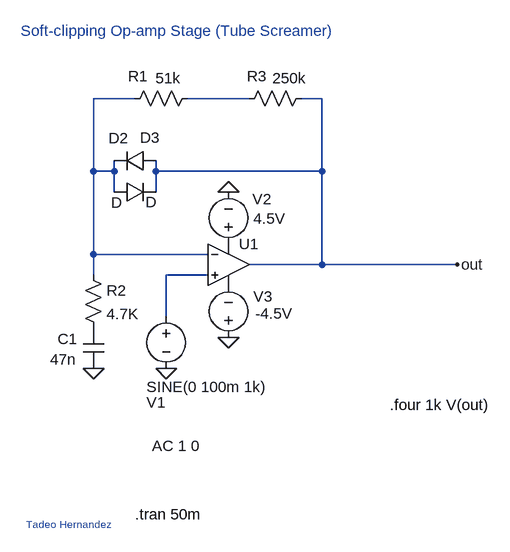
[diagram p0: schematic pedalcircuit.asc]
pedalcircuit.asc, the LTspice schematic file:
Version 4.1
SHEET 1 884 680
WIRE 160 -176 96 -176
WIRE 336 -176 240 -176
WIRE 448 -176 416 -176
WIRE 96 -64 96 -176
WIRE 128 -64 128 -80
WIRE 128 -64 96 -64
WIRE 192 -64 192 -80
WIRE 448 -64 448 -176
WIRE 448 -64 192 -64
WIRE 128 -32 128 -64
WIRE 192 -32 192 -64
WIRE 96 64 96 -64
WIRE 272 64 96 64
WIRE 448 80 448 -64
WIRE 448 80 336 80
WIRE 656 80 448 80
WIRE 96 96 96 64
WIRE 272 96 208 96
WIRE 208 160 208 96
FLAG 96 240 0
FLAG 304 192 0
FLAG 208 240 0
FLAG 304 -32 0
FLAG 656 80 out
SYMBOL diode 192 -96 R90
WINDOW 0 -3 57 VBottom 2
WINDOW 3 64 7 VTop 2
SYMATTR InstName D2
SYMBOL diode 128 -16 R270
WINDOW 0 84 55 VTop 2
WINDOW 3 15 4 VBottom 2
SYMATTR InstName D3
SYMBOL cap 80 176 R0
WINDOW 0 -39 18 Left 2
WINDOW 3 -51 50 Left 2
SYMATTR InstName C1
SYMATTR Value 47n
SYMBOL res 256 -192 R90
WINDOW 0 -3 91 VBottom 2
WINDOW 3 -31 45 VTop 2
SYMATTR InstName R1
SYMATTR Value 51k
SYMBOL voltage 208 144 R0
WINDOW 0 -30 148 Left 2
WINDOW 3 -30 124 Left 2
WINDOW 123 -22 215 Left 2
WINDOW 39 0 0 Left 0
SYMATTR InstName V1
SYMATTR Value SINE(0 100m 1k)
SYMATTR Value2 AC 1 0
SYMBOL voltage 304 208 R180
WINDOW 0 -68 79 Left 2
WINDOW 3 -99 53 Left 2
SYMATTR InstName V3
SYMATTR Value -4.5V
SYMBOL res 432 -192 R90
WINDOW 0 -3 84 VBottom 2
WINDOW 3 -31 34 VTop 2
SYMATTR InstName R3
SYMATTR Value 250k
SYMBOL voltage 304 64 R180
WINDOW 0 -66 85 Left 2
WINDOW 3 -88 55 Left 2
SYMATTR InstName V2
SYMATTR Value 4.5V
SYMBOL res 80 80 R0
SYMATTR InstName R2
SYMATTR Value 4.7K
SYMBOL OpAmps\\UniversalOpAmp1 304 80 R0
SYMATTR InstName U1
TEXT -16 -280 Left 2 ;Soft-clipping Op-amp Stage (Tube Screamer)
TEXT -8 480 Left 1 ;Tadeo Hernandez
TEXT 160 464 Left 2 !.tran 50m
TEXT 552 296 Left 2 !.four 1k V(out)

The netlist it stands for:
* pedalcircuit.asc
D2 out N001 D
D3 N001 out D
C1 P001 0 47n
R1 N002 N001 51k
V1 N003 0 SINE(0 100m 1k) AC 1 0
V3 0 P002 -4.5V
R3 out N002 250k
V2 P003 0 4.5V
R2 N001 P001 4.7K
X§U1 N003 N001 P003 P002 out level1 Avol=1Meg GBW=10Meg Vos=0 En=0 Enk=0 In=0 Ink=0 Rin=500Meg  ; pins In+ In- V+ V- OUT
.model D D
.lib standard.dio
* Soft-clipping Op-amp Stage (Tube Screamer)
* Tadeo Hernandez
.tran 50m
.four 1k V(out)
.lib UniversalOpAmp1.lib
.backanno
.end